# Altium schematic sheet Motor_Driver_Channel.SchDoc
size C; SheetNumber: 3; SheetTotal: 4
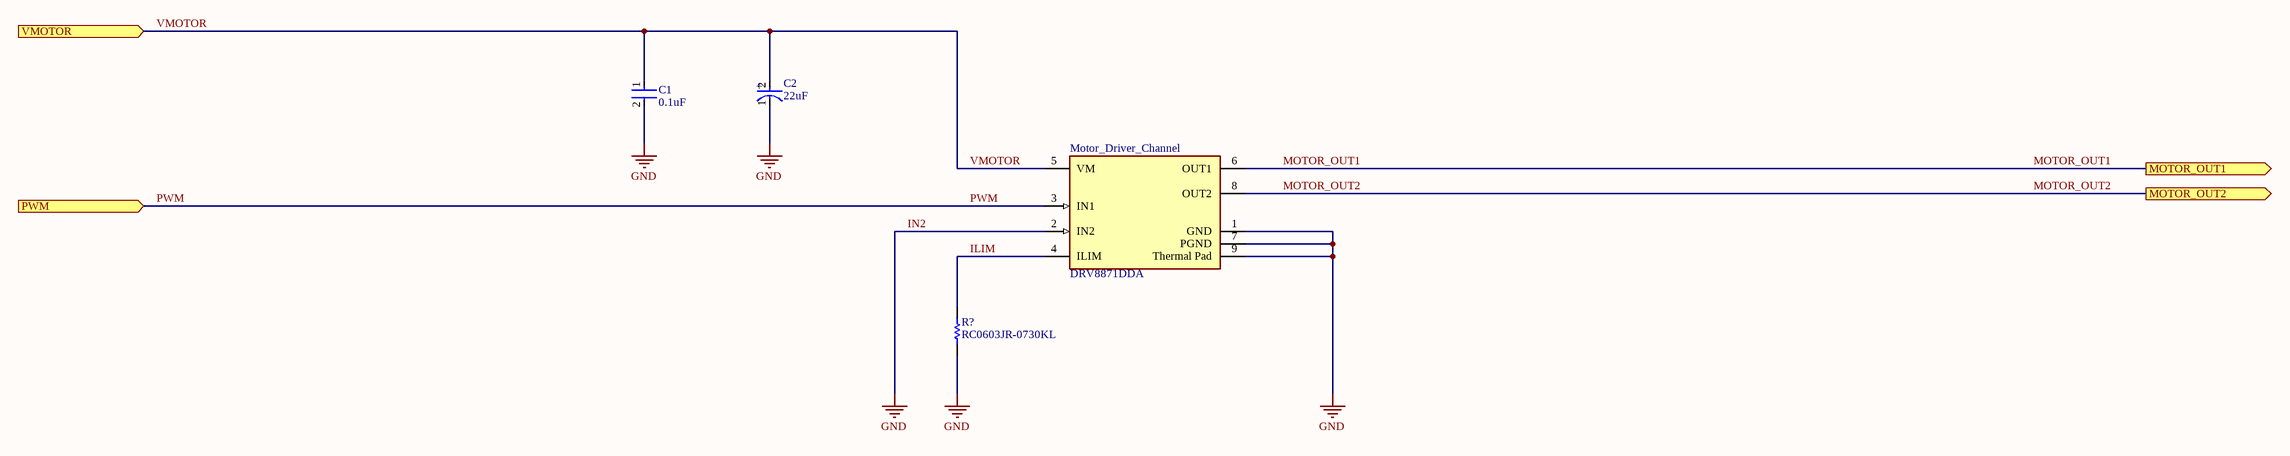
[diagram p0: Motor_Driver_Channel.SchDoc]

## Parts
C1  0.1uF  [FP-C0603C-CF-MFG]
C2  22uF  [FP-EEH-D8-MFG]
Motor_Driver_Channel  DRV8871DDA  [FP-DDA0008E-IPC_B]
R?  RC0603JR-0730KL  [RESC1608X55X25NL10T15]

## Ports
MOTOR_OUT1 (out), MOTOR_OUT2 (out), PWM (in), VMOTOR (in)

## Nets
IN2: C1.2 C2.1(C) Motor_Driver_Channel.1(GND) Motor_Driver_Channel.2(IN2) Motor_Driver_Channel.7(PGND) Motor_Driver_Channel.9(Thermal_Pad) R?.1  [also labelled GND]
ILIM: Motor_Driver_Channel.4(ILIM) R?.2
MOTOR_OUT1: Motor_Driver_Channel.6(OUT1) ; port MOTOR_OUT1
MOTOR_OUT2: Motor_Driver_Channel.8(OUT2) ; port MOTOR_OUT2
PWM: Motor_Driver_Channel.3(IN1) ; port PWM
VMOTOR: C1.1 C2.2(A) Motor_Driver_Channel.5(VM) ; port VMOTOR

## Notes on the sheet
- (in symbol CMP-05428-000551-1) +

## Library data of the parts
C1 = CMP-2006-03061-2: CAP CER 0.1UF 50V X7R 0603; Manufacturer: KEMET; Manufacturer Part Number: C0603C104K5RACTU; Tolerance: 0.1; Temperature Coefficient: 30ppm/°C; Material: Ceramic; Automotive Grade: Grade 1; Value: 0.10 μF; Temperature: -55°C to +125°C; RoHS: TRUE; Temperature Range High: +125°C; Lead Free: Yes; Octopart: https://octopart.com/c0603c104k5ractu-kemet-139244; Digikey Description: CAP CER 0.1UF 50V X7R 0603; Category: Cap; Package: C0603C-CF; ComponentLink2Description: Datasheet; Temperature Range Low: -55°C; Device Class L1: Passive Components; Voltage Rating: 50 V; Automotive: Yes; Device Class L3: Ceramic Capacitors; ComponentLink2URL: https://api.kemet.com/component-edge/download/datasheet/C0603C100J5GACAUTO.pdf; Capacitance: 0.10 μF; Device Class L2: Capacitors; Temperature Characteristic: X7R; Height: 0.87mm
C2 = CMP-05428-000551-1: Conductive Polymer Hybrid Aluminum Electrolytic Capacitors 22uF ±20% 63V RADIAL SMT 6.3x7.7mm; Life (Hours): 4000Hour; Ripple Current (AC): 900mA; ESR (Equivalent Series Resistance): 80mR; Lead Diameter: 0.65mm; Leakage Current: 3uA; Mount: Surface Mount; Case/Package: Radial; Capacitance: 22uF; Height - Seated (Max): 0.315inch; Voltage Rating: 63V; Min Operating Temperature: -55°C; Lead Free: Lead Free; Tolerance: 20%; Package Quantity: 900; Resistor Type: Hybrid; Radiation Hardening: No; Material: Polymer; Height: 7.7mm; Series: ZC; Voltage: 63V; Ripple Current: 900mA; RoHS Compliant: Yes; Diameter: 6.3mm; Termination: SMD/SMT; Max Operating Temperature: 125°C; Voltage Rating (DC): 63V; Number of Pins: 8; REACH SVHC: No SVHC; Length: 7.7mm; Technology: HYBRID; Ratings: AEC-Q200; Packaging: Tape and Reel; Lead Pitch: 1.8mm
Motor_Driver_Channel = CMP-04915-000036-1: IC MOTOR DRVR UNIPLR 8SO PWRPAD; Interface: PWM; Output Current: 3.6A; Logic Function: AND GATE; Max Operating Temperature: 125°C; Packaging: Rail/Tube; Lead Free: Lead Free; Mount: Surface Mount; RoHS Compliant: Yes; Number of Pins: 8; Min Operating Temperature: -40°C
R? = CMP-2000-04263-1: Manufacturer: Yageo; Part Number: RC0603JR-0730KL